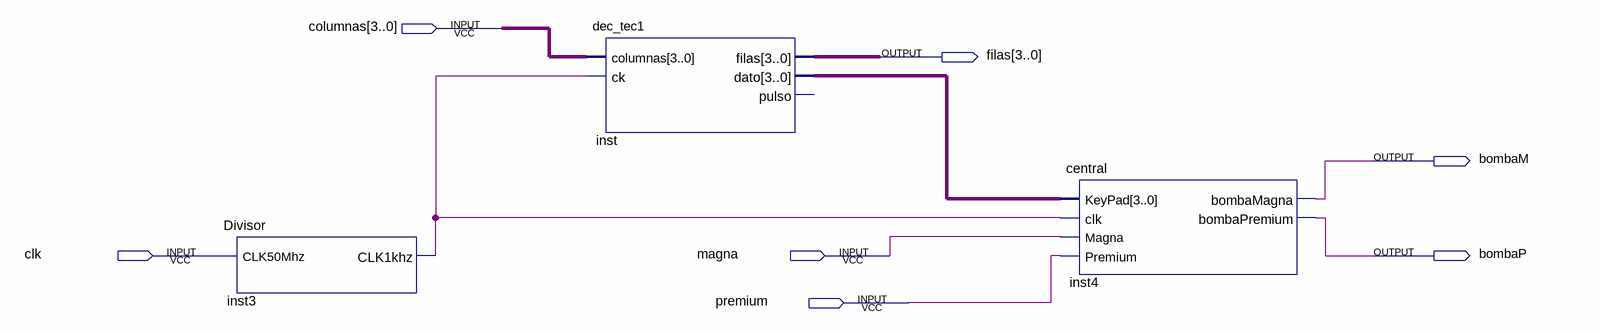
[diagram p0: schematic sheet]
// Quartus schematic Prueba2.bdf as structural Verilog: 3 symbols, 7 pins
module Prueba2 (
  input  [3:0] columnas,
  input  clk,
  input  magna,
  input  premium,
  output [3:0] filas,
  output bombaM,
  output bombaP
);

  wire inst3_clk1khz;
  wire [3:0] inst_dato;

  Divisor inst3 (.CLK50Mhz(clk), .CLK1khz(inst3_clk1khz));
  dec_tec1 inst (.columnas(columnas), .ck(inst3_clk1khz), .filas(filas), .dato(inst_dato));  // open: pulso
  central inst4 (
    .KeyPad(inst_dato), .clk(inst3_clk1khz), .Magna(magna), .Premium(premium), .bombaMagna(bombaM),
    .bombaPremium(bombaP));
endmodule
